# EAGLE design Timer Ventilador PIC (EAGLE 6.2)
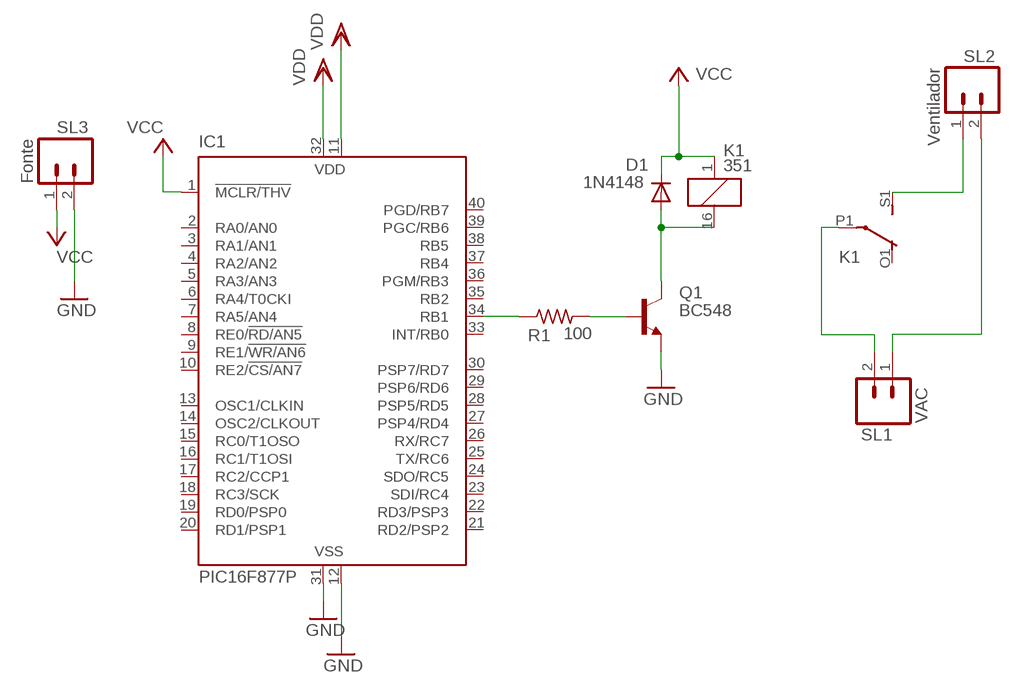
[diagram p0: schematic, sheet 1]

## Parts
D1  1N4148  1N4148DO35-7  [DO35-7]
IC1  PIC16F877P  [DIL40]
K1  351  [351]
Q1  BC548  [TO92-EBC]
R1  100  R-US_0204/7  [0204/7]
SL1  VAC  M02  [02P]
SL2  Ventilador  M02  [02P]
SL3  Fonte  M02  [02P]

## Nets
GND: IC1.12(VSS) IC1.31(VSS) Q1.E SL3.2
N$1: IC1.34(RB1) R1.1
N$2: Q1.B R1.2
N$3: K1.P1(2:P) SL1.2
N$4: D1.A K1.16 Q1.C
N$5: K1.S1(2:S) SL2.1
N$6: SL1.1 SL2.2
VCC: D1.C IC1.1(!MCLR/THV) K1.1 SL3.1
VDD: IC1.11(VDD) IC1.32(VDD)
Unconnected: IC1.2(RA0/AN0) IC1.3(RA1/AN1) IC1.4(RA2/AN2) IC1.5(RA3/AN3) IC1.6(RA4/T0CKI) IC1.7(RA5/AN4) IC1.8(RE0/!RD/AN5) IC1.9(RE1/!WR/AN6) IC1.10(RE2/!CS/AN7) IC1.13(OSC1/CLKIN) IC1.14(OSC2/CLKOUT) IC1.15(RC0/T1OSO) IC1.16(RC1/T1OSI) IC1.17(RC2/CCP1) IC1.18(RC3/SCK) IC1.19(RD0/PSP0) IC1.20(RD1/PSP1) IC1.21(RD2/PSP2) IC1.22(RD3/PSP3) IC1.23(SDI/RC4) IC1.24(SDO/RC5) IC1.25(TX/RC6) IC1.26(RX/RC7) IC1.27(PSP4/RD4) IC1.28(PSP5/RD5) IC1.29(PSP6/RD6) IC1.30(PSP7/RD7) IC1.33(INT/RB0) IC1.35(RB2) IC1.36(PGM/RB3) IC1.37(RB4) IC1.38(RB5) IC1.39(PGC/RB6) IC1.40(PGD/RB7) K1.O1(2:O) K1.O2(3:O) K1.P2(3:P) K1.S2(3:S)

## Library data of the parts
D1 = diode:1N4148: DIODE high speed (Philips)
IC1 = microchip:PIC16F87*: MICROCONTROLLER; MF: MICROCHIP; MPN: PIC16F877-04/P; OC_FARNELL: 9761349; OC_NEWARK: 61K3463
K1 = relay:351: RELAY 2 x switch, Omron; OC_FARNELL: unknown; OC_NEWARK: unknown
Q1 = transistor-npn:BC548*: NPN Transistor
R1 = rcl:R-US_: RESISTOR, American symbol
SL1-SL3 = con-amp-quick:M02: AMP QUICK CONNECTOR; OC_FARNELL: unknown; OC_NEWARK: unknown

## Board
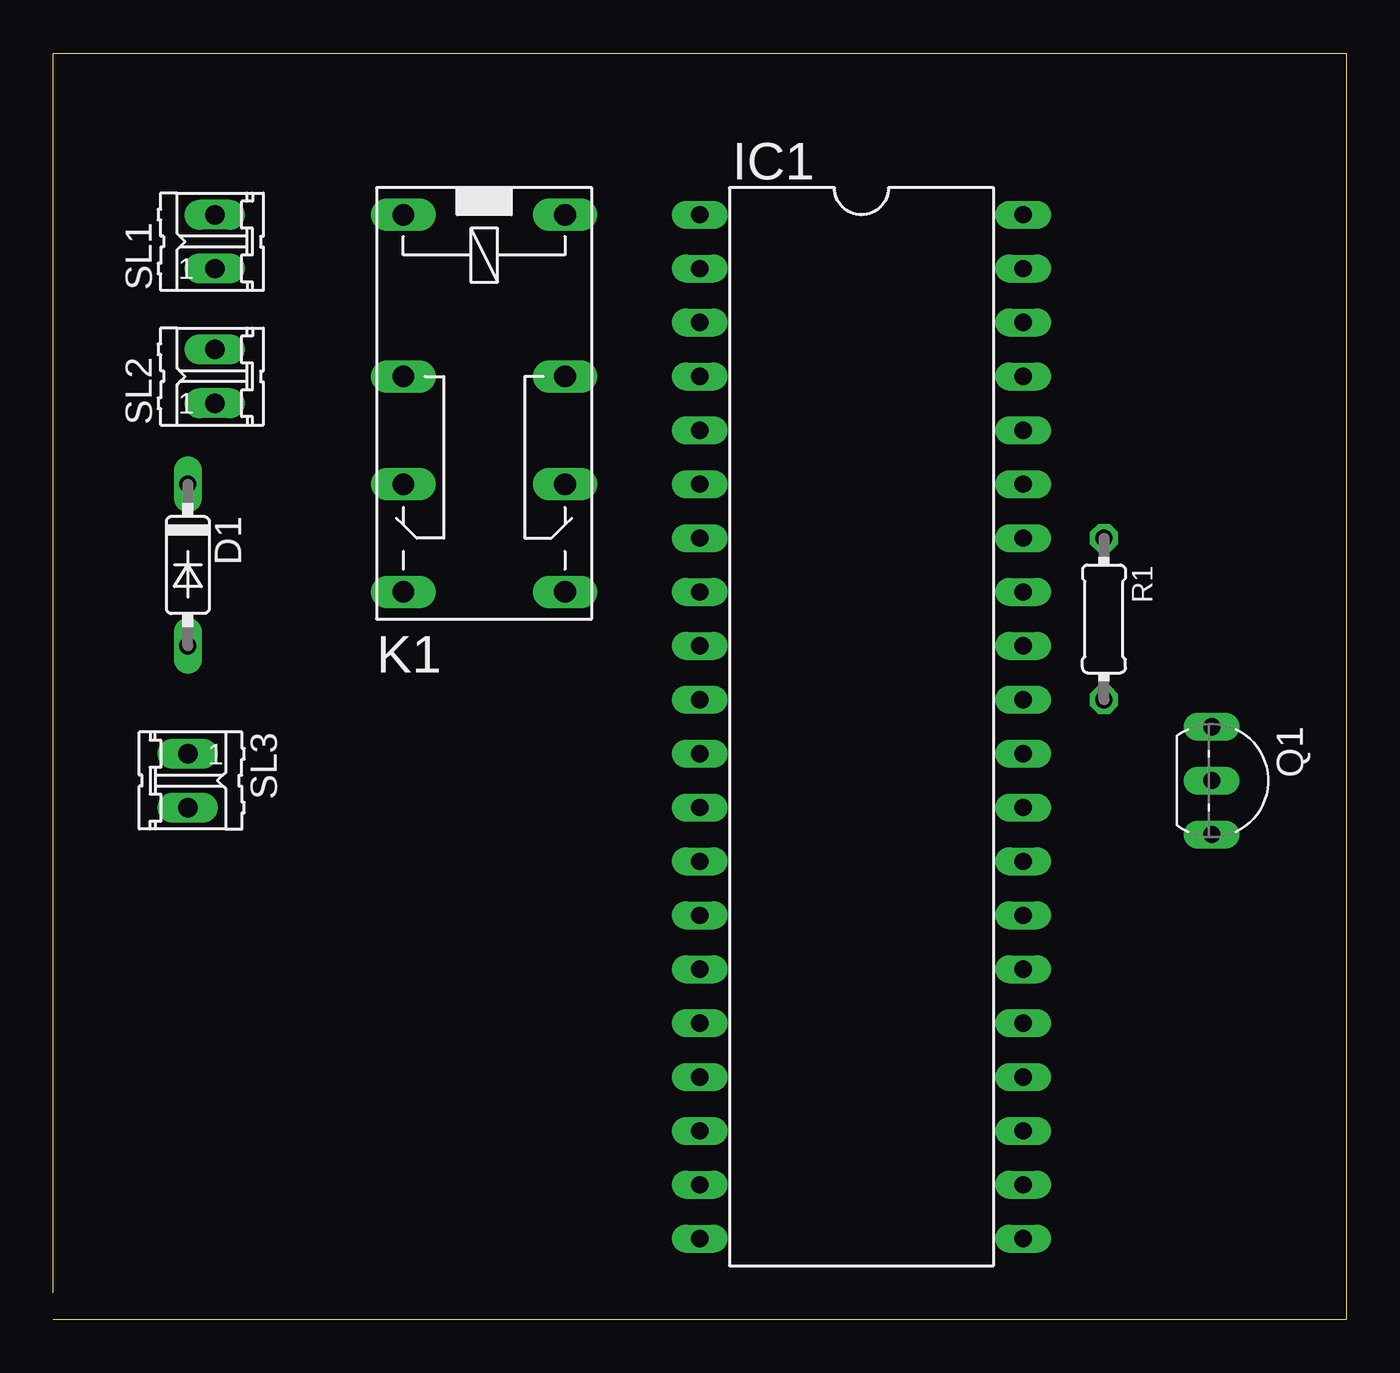
[diagram p1: board, top side]
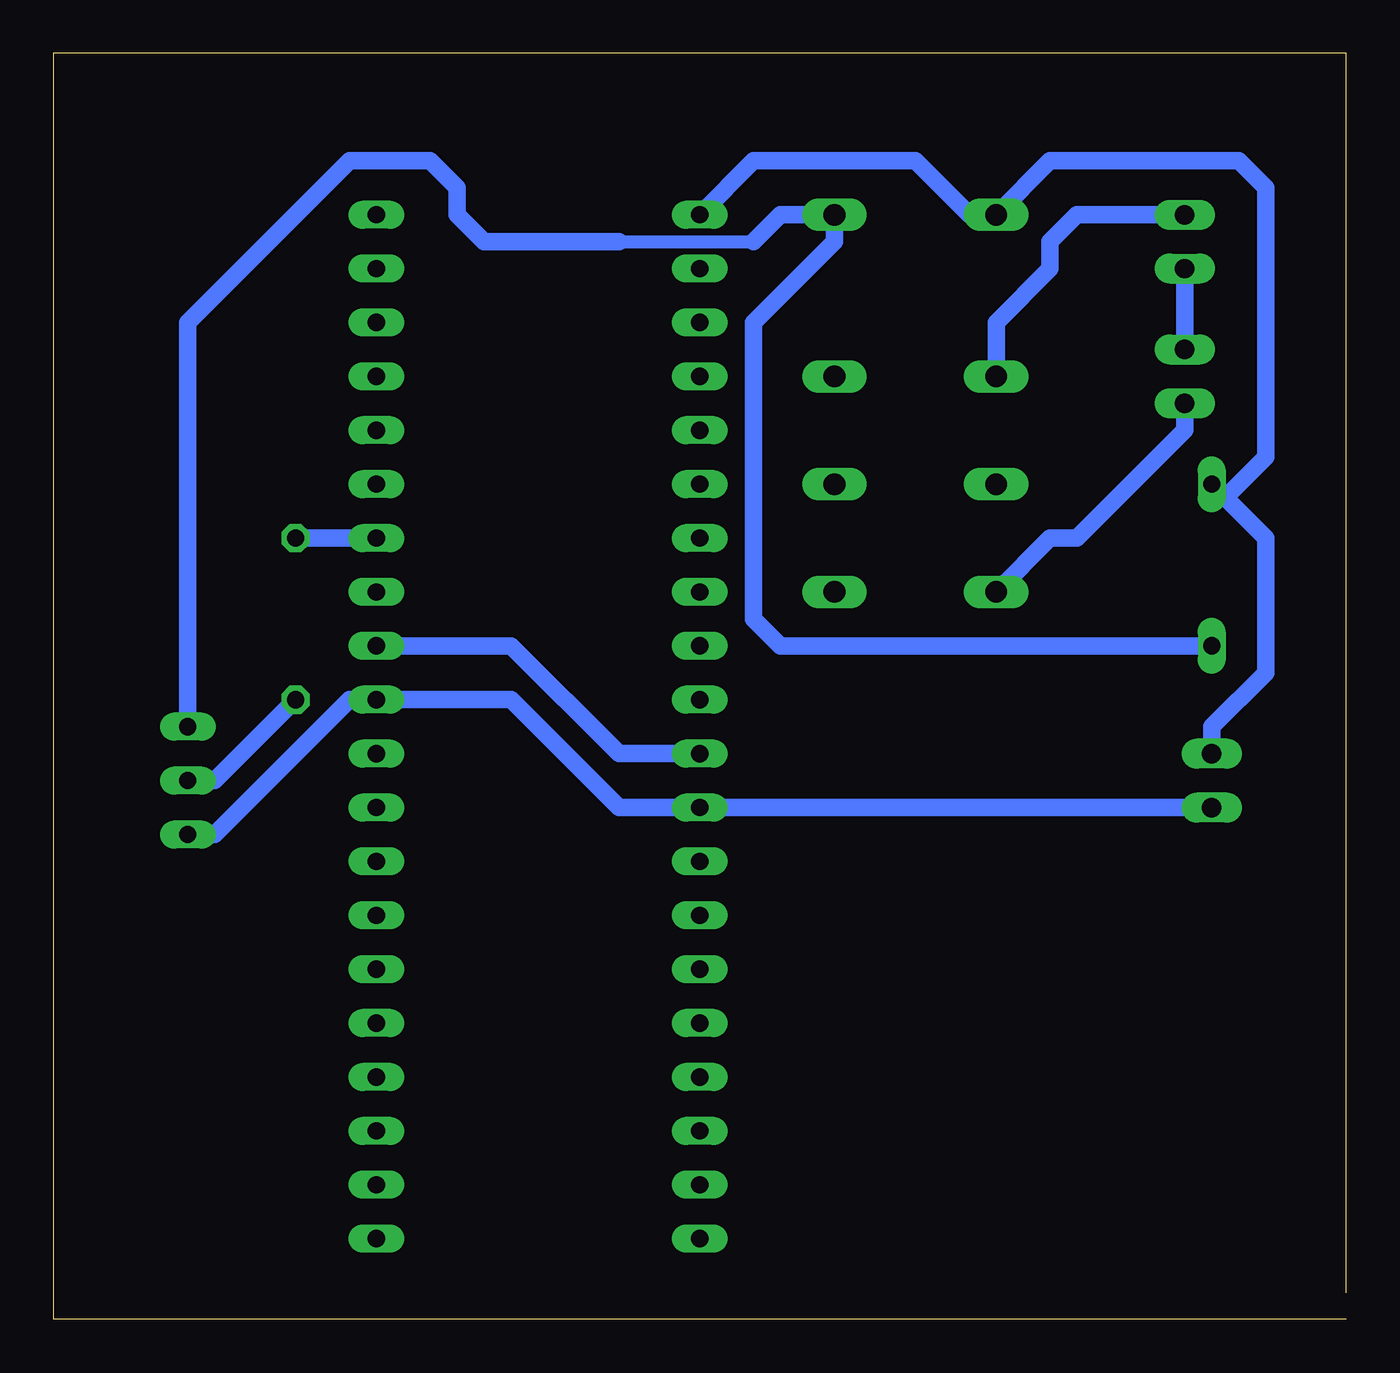
[diagram p2: board, bottom side, seen from below]

Size 60.96 x 59.69 mm. Coordinates in mm from the lower left corner, seen from the top.
Outline: 0,0 60.96,0 60.96,59.69 0,59.69 0,1.27
Copper layers (1*16): Top 0.035mm / dielectric 1.5mm / Bottom 0.035mm
Design rules: minimum track width 10mil, minimum drill 24mil, track to track 8mil, track to pad 8mil, pad to pad 8mil, via to via 8mil, smd to smd 8mil, copper to edge 40mil, drill to drill 8mil, minimum pad ring 10mil, minimum via ring 8mil, stop-mask expansion 4mil, vias tented up to drill 0mil, thermal gap 10mil

### Footprints (pad centres in the part's own frame; a part is rotated, then mirrored left to right if it is on the bottom)
DO35-7 = drill 0.813 long: A 3.81,0; C -3.81,0
DIL40 = drill 0.813 long: 1 -24.13,-7.62; 2 -21.59,-7.62; 3 -19.05,-7.62; 4 -16.51,-7.62; 5 -13.97,-7.62; 6 -11.43,-7.62; 7 -8.89,-7.62; 8 -6.35,-7.62; 9 -3.81,-7.62; 10 -1.27,-7.62; 11 1.27,-7.62; 12 3.81,-7.62; 13 6.35,-7.62; 14 8.89,-7.62; 15 11.43,-7.62; 16 13.97,-7.62; 17 16.51,-7.62; 18 19.05,-7.62; 19 21.59,-7.62; 20 24.13,-7.62; 21 24.13,7.62; 22 21.59,7.62; 23 19.05,7.62; 24 16.51,7.62; 25 13.97,7.62; 26 11.43,7.62; 27 8.89,7.62; 28 6.35,7.62; 29 3.81,7.62; 30 1.27,7.62; 31 -1.27,7.62; 32 -3.81,7.62; 33 -6.35,7.62; 34 -8.89,7.62; 35 -11.43,7.62; 36 -13.97,7.62; 37 -16.51,7.62; 38 -19.05,7.62; 39 -21.59,7.62; 40 -24.13,7.62
351 = drill 1.016 long: 1 -3.81,-3.81; 16 -3.81,3.81; O1 8.89,-3.81; O2 8.89,3.81; P1 3.81,-3.81; P2 3.81,3.81; S1 13.97,-3.81; S2 13.97,3.81
TO92-EBC = drill 0.813 long: B 0,-1.27; C -2.54,-1.27; E 2.54,-1.27
0204/7 = drill 0.813 octagon: 1 -3.81,0; 2 3.81,0
02P = drill 0.914 long: 1 -1.27,0; 2 1.27,0

### Placement (x,y rotation side)
D1  6.35,35.56 270 top
IC1  38.1,27.94 270 top
K1  20.32,48.26 270 top
Q1  55.88,25.4 270 top
R1  49.53,33.02 270 top
SL1  7.62,50.8 90 top
SL2  7.62,44.45 90 top
SL3  6.35,25.4 270 top

### Tracks (layer width: path | path; a pad name or v marks a point on that pad's centre or on a via)
GND
  Bottom 0.813: SL3.2 IC1.12 34.29,24.13 39.37,29.21 IC1.31 46.99,29.21 53.34,22.86 Q1.E
N$1
  Bottom 0.813: IC1.34 R1.1
N$2
  Bottom 0.813: Q1.B 53.34,25.4 R1.2
N$3
  Bottom 0.813: SL1.2 12.7,52.07 13.97,50.8 13.97,49.53 16.51,46.99 K1.P1
N$4
  Bottom 0.61: 34.29,50.8 27.94,50.8
  Bottom 0.813: D1.A 26.67,31.75 27.94,33.02 27.94,46.99 24.13,50.8 K1.16 26.67,52.07 27.94,50.8 | Q1.C 54.61,46.99 46.99,54.61 43.18,54.61 41.91,53.34 41.91,52.07 40.64,50.8 34.29,50.8
N$5
  Bottom 0.813: SL2.1 7.62,41.91 12.7,36.83 13.97,36.83 K1.S1
N$6
  Bottom 0.813: SL2.2 SL1.1
VCC
  Bottom 0.813: SL3.1 6.35,27.94 3.81,30.48 3.81,36.83 5.71,38.73 | 5.71,38.73 D1.C | 5.71,38.73 3.81,40.64 3.81,53.34 5.08,54.61 13.97,54.61 K1.1 17.78,52.07 20.32,54.61 27.94,54.61 IC1.1
VDD
  Bottom 0.813: IC1.11 34.29,26.67 39.37,31.75 IC1.32